# Altium schematic sheet TD3_TP3_ESP32.SchDoc: Instrumento virtual con ESP32
size 420 x 297 mm; Revision: C; SheetNumber: 1; SheetTotal: 1; Proyecto: UTN FRC, Técnicas Digitales III, TP3
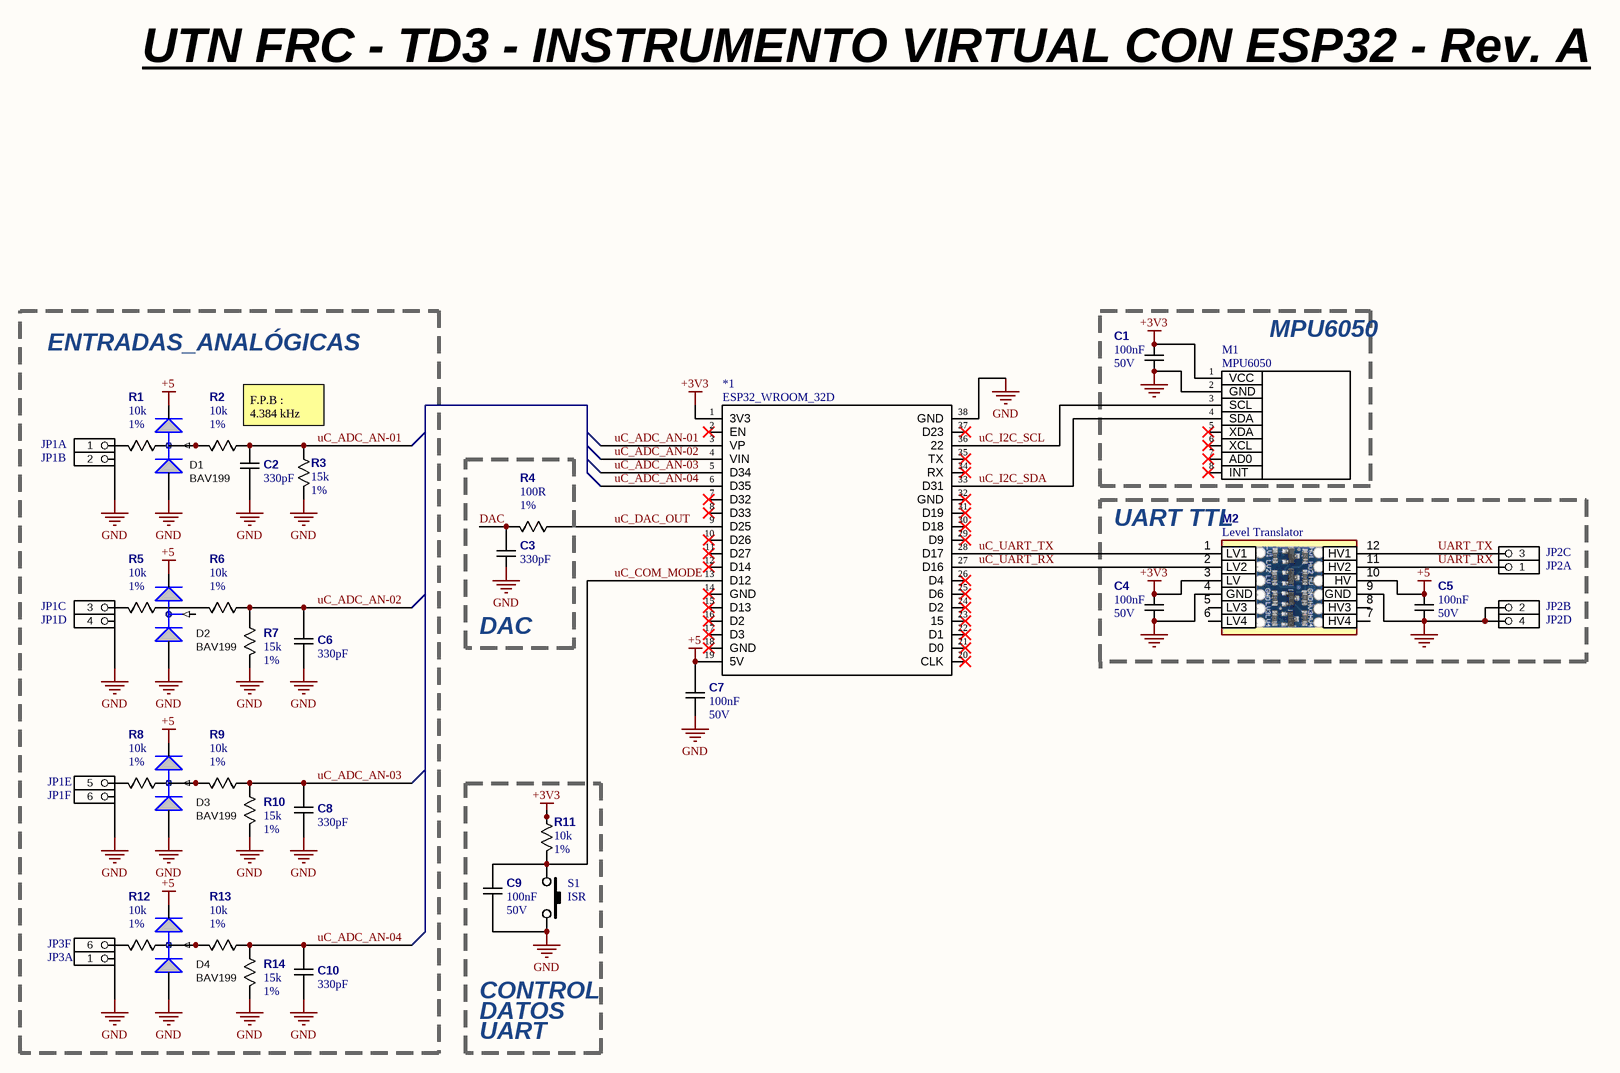
[diagram p0: TD3_TP3_ESP32.SchDoc]

## Parts
*1  ESP32_WROOM_32D
C1  VALOR: 100nF  TENSION: 50V  [C_0805_RFW]  (hidden comment: Cap No Pol)
C2  330pF  [C_0805_RFW]
C3  330pF  [C_0805_RFW]
C4  VALOR: 100nF  TENSION: 50V  [C_0805_RFW]  (hidden comment: Cap No Pol)
C5  100nF  TENSION: 50V  [C_0805_RFW]
C6  330pF  [C_0805_RFW]
C7  VALOR: 100nF  TENSION: 50V  [C_0805_RFW]  (hidden comment: Cap No Pol)
C8  330pF  [C_0805_RFW]
C9  VALOR: 100nF  TENSION: 50V  [C_0805_RFW]  (hidden comment: Cap No Pol)
C10  330pF  [C_0805_RFW]
D1  BAV199  [SOT_23_3_1_RFW]
D2  BAV199  [SOT_23_3_1_RFW]
D3  BAV199  [SOT_23_3_1_RFW]
D4  BAV199  [SOT_23_3_1_RFW]
JP1  HEADER PART  [PIN_1X6_MACHO_2.54]  (value not drawn)  (parts A,B,C,D,E,F of 6)
JP2  HEADER PART  [PIN_1X4_MACHO_2.54]  (value not drawn)  (parts A,B,C,D of 4)
JP3  HEADER PART  [PIN_1X6_MACHO_2.54]  (value not drawn)  (parts A,F of 6)
M1  MPU6050
M2  Level Translator  [Level_Translator_FET]
R1  10k  Tolerancia: 1%  [R_0805_RFW]
R2  10k  Tolerancia: 1%  [R_0805_RFW]
R3  15k  Tolerancia: 1%  [R_0805_RFW]
R4  100R  Tolerancia: 1%  [R_0805_RFW]
R5  10k  Tolerancia: 1%  [R_0805_RFW]
R6  10k  Tolerancia: 1%  [R_0805_RFW]
R7  15k  Tolerancia: 1%  [R_0805_RFW]
R8  10k  Tolerancia: 1%  [R_0805_RFW]
R9  10k  Tolerancia: 1%  [R_0805_RFW]
R10  15k  Tolerancia: 1%  [R_0805_RFW]
R11  10k  Tolerancia: 1%  [R_0805_RFW]
R12  10k  Tolerancia: 1%  [R_0805_RFW]
R13  10k  Tolerancia: 1%  [R_0805_RFW]
R14  15k  Tolerancia: 1%  [R_0805_RFW]
S1  ISR

## Blocks framed on the sheet
ENTRADAS_ANALÓGICAS: C2 C6 C8 C10 D1-D4 JP1 JP3 R1-R3 R5-R10 R12-R14
MPU6050: C1 M1
DAC: C3 R4

## Nets
+3V3: *1.1(3V3) C1.2 C4.2 M1.1(VCC) M2.3(LV) R11.1
+5: *1.19(5V) C5.1 C7.1 D1.2 D2.2 D3.2 D4.2 M2.10(HV)
GND: *1.38(GND) C1.1 C2.1 C3.1 C4.1 C5.2 C6.1 C7.2 C8.1 C9.2 C10.1 D1.1 D2.1 D3.1 D4.1 JP1.2 JP1.4 JP1.6 JP2.2 JP2.4 JP3.1 M1.2(GND) M2.4(GND) M2.9(GND) R3.2 R7.2 R10.2 R14.2 S1.2
DAC: C3.2 R4.2
UART_RX: JP2.1 M2.11(HV2)
UART_TX: JP2.3 M2.12(HV1)
uC_ADC_AN-01: *1.3(VP) C2.2 R2.1 R3.1
uC_ADC_AN-02: *1.4(VIN) C6.2 R6.1 R7.1
uC_ADC_AN-03: *1.5(D34) C8.2 R9.1 R10.1
uC_ADC_AN-04: *1.6(D35) C10.2 R13.1 R14.1
uC_COM_MODE: *1.13(D12) C9.1 R11.2 S1.1
uC_DAC_OUT: *1.9(D25) R4.1
uC_I2C_SCL: *1.36(22) M1.3(SCL)
uC_I2C_SDA: *1.33(D31) M1.4(SDA)
uC_UART_RX: *1.27(D16) M2.2(LV2)
uC_UART_TX: *1.28(D17) M2.1(LV1)
NetD1_3: D1.3 R1.1 R2.2
NetD3_3: D3.3 R8.1 R9.2
NetD4_3: D4.3 R12.1 R13.2
NetJP1_1: JP1.1 R1.2
NetJP1_3: JP1.3 R5.2
NetJP1_5: JP1.5 R8.2
NetJP3_6: JP3.6 R12.2
NetR5_1: R5.1 R6.2

Not connected (* = marked no-connect by the designer): *1 2(EN)* 7(D32)* 8(D33)* 10(D26)* 11(D27)* 12(D14)* 14(GND)* 15(D13)* 16(D2)* 17(D3)* 18(GND)* 20(CLK)* 21(D0)* 22(D1)* 23(15)* 24(D2)* 25(D6)* 26(D4)* 29(D9)* 30(D18)* 31(D19)* 32(GND)* 34(RX)* 35(TX)* 37(D23)*; D2 3; M1 5(XDA)* 6(XCL)* 7(AD0)* 8(INT)*; M2 5(LV3) 6(LV4) 7(HV4) 8(HV3)

## Notes on the sheet
- UTN FRC - TD3 - INSTRUMENTO VIRTUAL CON ESP32 - Rev. A
- F.P.B :
  4.384 kHz
- UART TTL
- CONTROL
- DATOS
- UART
- TÍTULO
- REV
- FILE NAME
- HOJA
- A3
- PROYECTO
- SHEET
- OF

## Library data of the parts
C1-C10 = CAPACITOR NP: ENCAPSULADO: *; MONTAJE: *; DIELECTRICO: *; COMPONENTE: CAPACITOR; MFR PN: *; DIGIKEY PN: *; DATASHEET: *
  C2 C3 C6 C8 C10: VALOR: *; TENSION: *
D1-D4 = BAV99: Par de Diodos Serie; CODIGO: 3401; DESCRIPCION: Low leakage switching diodes, BAV199 serie 70V 250mW sot-23 smd; CLASE: 1; ENCAPSULADO: SMD; VERSION: 0
JP1 JP3 = PART HEADER 6: HEADER PART 6; CODIGO: *; VERSION: *; DESCRIPCION: *; CLASE: *; ENCAPSULADO: *
JP2 = PART HEADER 4: HEADER PART 4; CODIGO: *; VERSION: *; DESCRIPCION: *; CLASE: *; ENCAPSULADO: *
M2 = Level_Translator_FET: Conversor de nivel JFET
R1-R14 = RESISTOR: VALOR: *; MONTAJE: *; ENCAPSULADO: *; TENSIÓN: *; COMPONENTE: RESISTOR; MFR PN: *; DIGIKEY PN: *; DATASHEET: *
S1 = SW-PULSADOR: SWITCH PULSADOR; CODIGO: *; VERSION: *; DESCRIPCION: *; CLASE: *; ENCAPSULADO: *